# Altium schematic sheet cm4.SchDoc: Cortex M4 Module
size A3; SheetNumber: 21; SheetTotal: 21
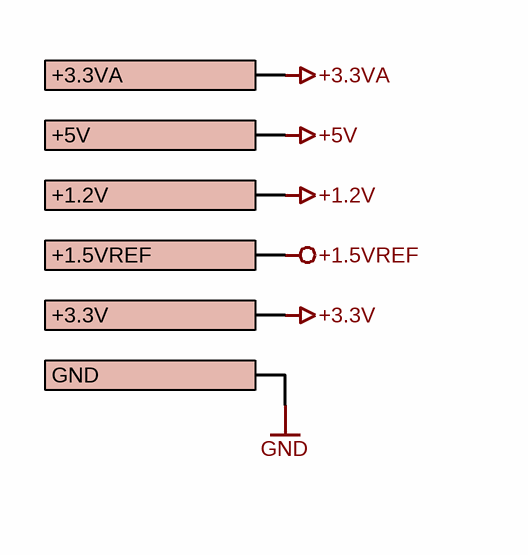
[diagram p0: cm4.SchDoc]

## Ports
+1.2V, +1.5VREF, +3.3V, +3.3VA, +5V, GND

## Nets
+1.2V: port +1.2V
+1.5VREF: port +1.5VREF
+3.3V: port +3.3V
+3.3VA: port +3.3VA
+5V: port +5V
GND: port GND

## Notes on the sheet
- HES-SO / HEIG-VD / TIN / IAI
  Route de Cheseaux, 1
  CH-1401 Yverdon-les-Bains
  T +41 24 557 73 77    F +41 24 557 63 20
  http://iai.heig-vd.ch
  iai@heig-vd.ch
- Title
- Size
- Date
- A4
- Project
- Sheet
- of
- No.
- Author
- SVN/Git
- Version
- File